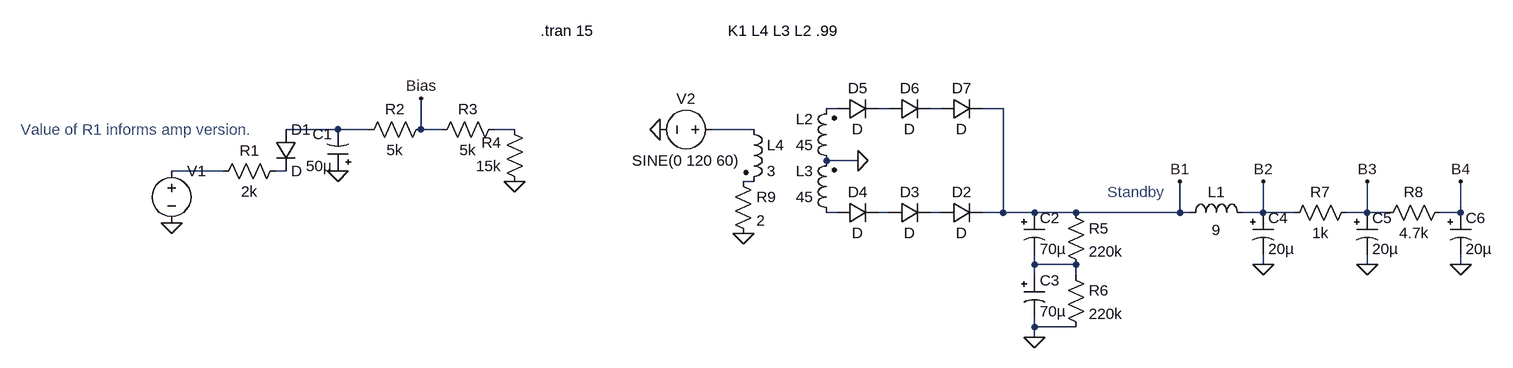
[diagram p0: schematic Draft1.asc]
Draft1.asc, the LTspice schematic file:
Version 4
SHEET 1 2216 680
WIRE 1200 128 1184 128
WIRE 1280 128 1264 128
WIRE 1360 128 1344 128
WIRE 1456 128 1424 128
WIRE 432 160 352 160
WIRE 480 160 432 160
WIRE 560 160 560 112
WIRE 592 160 560 160
WIRE 704 160 672 160
WIRE 1072 160 1008 160
WIRE 1232 208 1184 208
WIRE 256 224 176 224
WIRE 352 224 336 224
WIRE 1072 240 1056 240
WIRE 1200 288 1184 288
WIRE 1280 288 1264 288
WIRE 1360 288 1344 288
WIRE 1456 288 1456 128
WIRE 1456 288 1424 288
WIRE 1504 288 1456 288
WIRE 1568 288 1504 288
WIRE 1728 288 1728 240
WIRE 1728 288 1568 288
WIRE 1744 288 1728 288
WIRE 1856 288 1856 240
WIRE 1856 288 1824 288
WIRE 1904 288 1856 288
WIRE 2016 288 2016 240
WIRE 2016 288 1984 288
WIRE 2048 288 2016 288
WIRE 2160 288 2160 240
WIRE 2160 288 2128 288
WIRE 1504 368 1504 352
WIRE 1568 368 1504 368
WIRE 1856 368 1856 352
WIRE 2016 368 2016 352
WIRE 2160 368 2160 352
WIRE 1504 384 1504 368
WIRE 1568 384 1568 368
WIRE 1504 464 1504 448
WIRE 1568 464 1504 464
WIRE 1504 480 1504 464
FLAG 176 304 0
FLAG 432 224 0
FLAG 704 240 0
FLAG 560 112 Bias
FLAG 1504 480 0
FLAG 1856 368 0
FLAG 2016 368 0
FLAG 2160 368 0
FLAG 1728 240 B1
FLAG 1856 240 B2
FLAG 2016 240 B3
FLAG 2160 240 B4
FLAG 1232 208 0
FLAG 1056 320 0
FLAG 928 160 0
SYMBOL voltage 176 208 R0
WINDOW 3 24 104 Invisible 0
WINDOW 123 0 0 Left 0
WINDOW 39 0 0 Left 0
SYMATTR Value SINE(0 75 60)
SYMATTR InstName V1
SYMBOL res 352 208 R90
WINDOW 0 0 56 VBottom 0
WINDOW 3 32 56 VTop 0
SYMATTR InstName R1
SYMATTR Value 2k
SYMBOL diode 336 160 R0
SYMATTR InstName D1
SYMBOL polcap 448 224 R180
WINDOW 0 24 57 Left 0
WINDOW 3 24 8 Left 0
SYMATTR InstName C1
SYMATTR Value 50µ
SYMATTR SpiceLine V=70
SYMBOL res 576 144 R90
WINDOW 0 0 56 VBottom 0
WINDOW 3 32 56 VTop 0
SYMATTR InstName R2
SYMATTR Value 5k
SYMBOL res 688 144 R90
WINDOW 0 0 56 VBottom 0
WINDOW 3 32 56 VTop 0
SYMATTR InstName R3
SYMATTR Value 5k
SYMBOL res 720 256 R180
WINDOW 0 36 76 Left 0
WINDOW 3 36 40 Left 0
SYMATTR InstName R4
SYMATTR Value 15k
SYMBOL polcap 1488 288 R0
SYMATTR InstName C2
SYMATTR Value 70µ
SYMATTR SpiceLine V=350
SYMBOL polcap 1488 384 R0
SYMATTR InstName C3
SYMATTR Value 70µ
SYMATTR SpiceLine V=350
SYMBOL res 1552 272 R0
SYMATTR InstName R5
SYMATTR Value 220k
SYMATTR SpiceLine pwr=1
SYMBOL res 1552 368 R0
SYMATTR InstName R6
SYMATTR Value 220k
SYMATTR SpiceLine pwr=1
SYMBOL ind 1728 304 R270
WINDOW 0 32 56 VTop 0
WINDOW 3 5 56 VBottom 0
SYMATTR InstName L1
SYMATTR Value 9
SYMBOL polcap 1840 288 R0
SYMATTR InstName C4
SYMATTR Value 20µ
SYMATTR SpiceLine Irms=525
SYMBOL res 2000 272 R90
WINDOW 0 0 56 VBottom 0
WINDOW 3 32 56 VTop 0
SYMATTR InstName R7
SYMATTR Value 1k
SYMATTR SpiceLine pwr=1
SYMBOL res 2144 272 R90
WINDOW 0 0 56 VBottom 0
WINDOW 3 32 56 VTop 0
SYMATTR InstName R8
SYMATTR Value 4.7k
SYMBOL polcap 2000 288 R0
SYMATTR InstName C5
SYMATTR Value 20µ
SYMATTR SpiceLine Irms=525
SYMBOL polcap 2144 288 R0
SYMATTR InstName C6
SYMATTR Value 20µ
SYMATTR SpiceLine Irms=525
SYMBOL diode 1360 304 R270
WINDOW 0 32 32 VTop 0
WINDOW 3 0 32 VBottom 0
SYMATTR InstName D2
SYMBOL diode 1280 304 R270
WINDOW 0 32 32 VTop 0
WINDOW 3 0 32 VBottom 0
SYMATTR InstName D3
SYMBOL diode 1200 304 R270
WINDOW 0 32 32 VTop 0
WINDOW 3 0 32 VBottom 0
SYMATTR InstName D4
SYMBOL diode 1200 144 R270
WINDOW 0 32 32 VTop 0
WINDOW 3 0 32 VBottom 0
SYMATTR InstName D5
SYMBOL diode 1280 144 R270
WINDOW 0 32 32 VTop 0
WINDOW 3 0 32 VBottom 0
SYMATTR InstName D6
SYMBOL diode 1360 144 R270
WINDOW 0 32 32 VTop 0
WINDOW 3 0 32 VBottom 0
SYMATTR InstName D7
SYMBOL ind2 1200 224 R180
WINDOW 0 36 80 Left 0
WINDOW 3 36 40 Left 0
SYMATTR InstName L2
SYMATTR Value 45
SYMATTR Type ind
SYMBOL ind2 1200 304 R180
WINDOW 0 36 80 Left 0
WINDOW 3 36 40 Left 0
SYMATTR InstName L3
SYMATTR Value 45
SYMATTR Type ind
SYMBOL ind2 1056 144 R0
SYMATTR InstName L4
SYMATTR Value 3
SYMATTR Type ind
SYMBOL res 1040 224 R0
SYMATTR InstName R9
SYMATTR Value 2
SYMBOL voltage 1024 160 R90
WINDOW 0 -32 56 VBottom 0
WINDOW 3 32 56 VTop 0
WINDOW 123 0 0 Left 0
WINDOW 39 0 0 Left 0
SYMATTR InstName V2
SYMATTR Value SINE(0 120 60)
TEXT -56 160 Left 0 ;Value of R1 informs amp version.
TEXT 744 8 Left 0 !.tran 15
TEXT 1616 256 Left 0 ;Standby
TEXT 1032 8 Left 0 !K1 L4 L3 L2 .99

The netlist it stands for:
* Draft1.asc
V1 N007 0 SINE(0 75 60)
R1 N008 N007 2k
D1 N004 N008 D
C1 0 N004 50µ V=70
R2 Bias N004 5k
R3 N005 Bias 5k
R4 0 N005 15k
C2 B1 N013 70µ V=350
C3 N013 0 70µ V=350
R5 B1 N013 220k pwr=1
R6 N013 0 220k pwr=1
L1 B1 B2 9
C4 B2 0 20µ Irms=525
R7 B3 B2 1k pwr=1
R8 B4 B3 4.7k
C5 B3 0 20µ Irms=525
C6 B4 0 20µ Irms=525
D2 N012 B1 D
D3 N011 N012 D
D4 N010 N011 D
D5 N001 N002 D
D6 N002 N003 D
D7 N003 B1 D
L2 0 N001 45
L3 N010 0 45
L4 N006 N009 3
R9 N009 0 2
V2 N006 0 SINE(0 120 60)
.model D D
.lib standard.dio
* Value of R1 informs amp version.
.tran 15
* Standby
K1 L4 L3 L2 .99
.backanno
.end